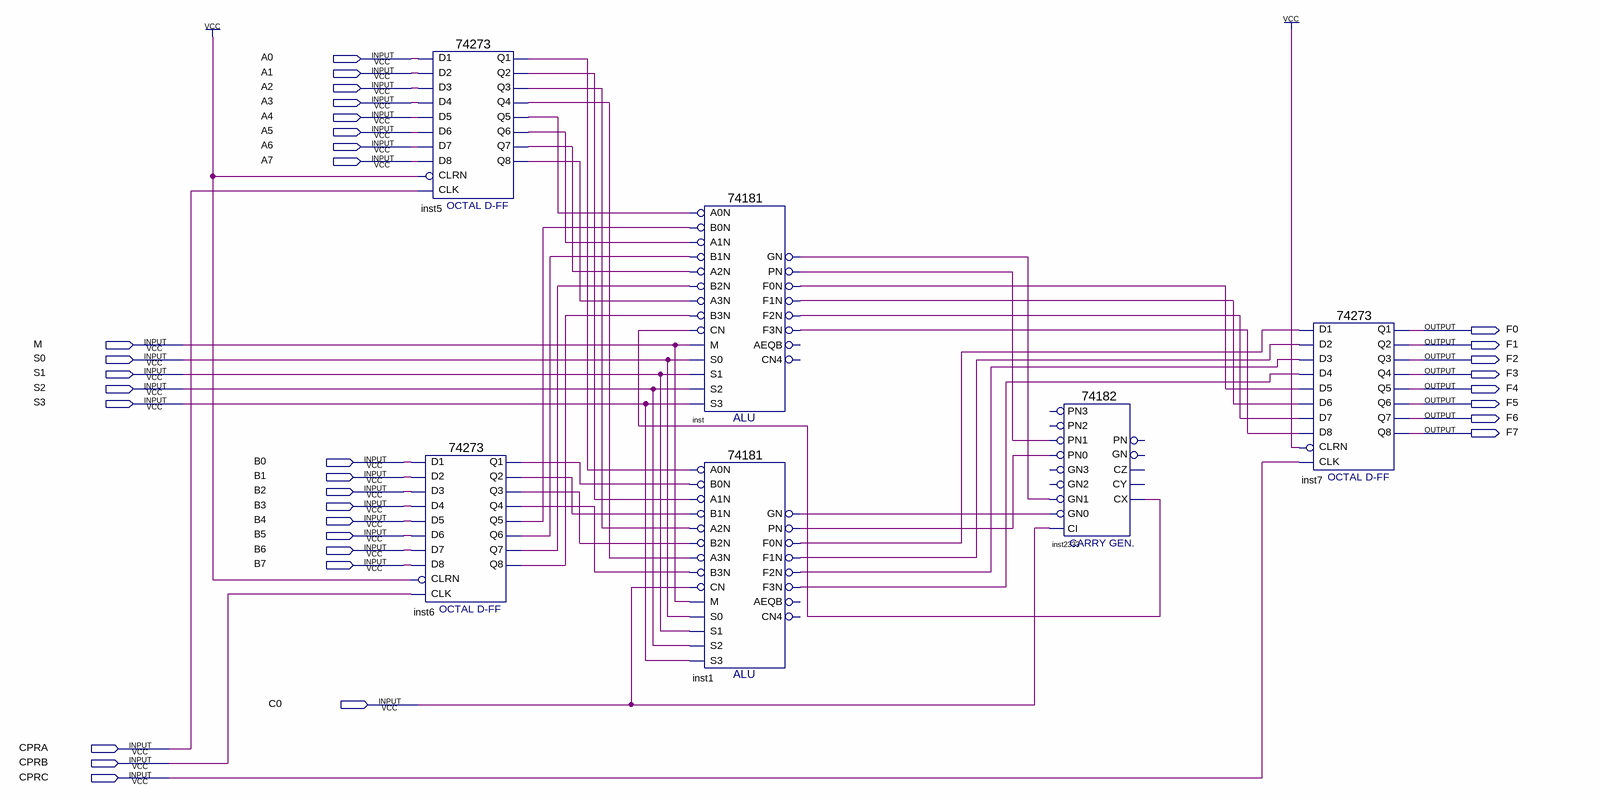
[diagram p0: schematic sheet]
// Quartus schematic ALU.bdf as structural Verilog: 6 symbols, 33 pins
module ALU (
  input  A0,
  input  A1,
  input  A2,
  input  A3,
  input  A4,
  input  A5,
  input  A6,
  input  A7,
  input  M,
  input  S0,
  input  S1,
  input  S2,
  input  S3,
  input  B0,
  input  B1,
  input  B2,
  input  B3,
  input  B4,
  input  B5,
  input  B6,
  input  B7,
  input  C0,
  input  CPRA,
  input  CPRB,
  input  CPRC,
  output F0,
  output F1,
  output F2,
  output F3,
  output F4,
  output F5,
  output F6,
  output F7
);

  wire inst1_f0n, inst1_f1n, inst1_f2n, inst1_f3n, inst1_gn, inst1_pn, inst5_q1, inst5_q2, inst5_q3,
       inst5_q4, inst5_q5, inst5_q6, inst5_q7, inst5_q8, inst6_q1, inst6_q2, inst6_q3, inst6_q4, inst6_q5,
       inst6_q6, inst6_q7, inst6_q8, inst2333_cx, inst_f0n, inst_f1n, inst_f2n, inst_f3n, inst_gn, inst_pn;

  \74273  inst5 (
    .D2(A1), .D3(A2), .D1(A0), .D4(A3), .D7(A6), .D6(A5), .D5(A4), .D8(A7), .CLK(CPRA), .CLRN(1'b1),
    .Q4(inst5_q4), .Q1(inst5_q1), .Q2(inst5_q2), .Q3(inst5_q3), .Q6(inst5_q6), .Q5(inst5_q5), .Q7(inst5_q7),
    .Q8(inst5_q8));
  \74273  inst6 (
    .D2(B1), .D3(B2), .D1(B0), .D4(B3), .D7(B6), .D6(B5), .D5(B4), .D8(B7), .CLK(CPRB), .CLRN(1'b1),
    .Q4(inst6_q4), .Q1(inst6_q1), .Q2(inst6_q2), .Q3(inst6_q3), .Q6(inst6_q6), .Q5(inst6_q5), .Q7(inst6_q7),
    .Q8(inst6_q8));
  \74181  inst (
    .B0N(inst6_q5), .A0N(inst5_q5), .A1N(inst5_q6), .B1N(inst6_q6), .A3N(inst5_q8), .B2N(inst6_q7),
    .A2N(inst5_q7), .M(M), .CN(inst2333_cx), .B3N(inst6_q8), .S2(S2), .S1(S1), .S0(S0), .S3(S3),
    .PN(inst_pn), .GN(inst_gn), .F3N(inst_f3n), .F1N(inst_f1n), .F0N(inst_f0n), .F2N(inst_f2n));  // open: AEQB, CN4
  \74181  inst1 (
    .B0N(inst6_q1), .A0N(inst5_q1), .A1N(inst5_q2), .B1N(inst6_q2), .A3N(inst5_q4), .B2N(inst6_q3),
    .A2N(inst5_q3), .M(M), .CN(C0), .B3N(inst6_q4), .S2(S2), .S1(S1), .S0(S0), .S3(S3), .PN(inst1_pn),
    .GN(inst1_gn), .F3N(inst1_f3n), .F1N(inst1_f1n), .F0N(inst1_f0n), .F2N(inst1_f2n));  // open: AEQB, CN4
  \74182  inst2333 (
    .CI(C0), .PN1(inst_pn), .PN0(inst1_pn), .GN1(inst_gn), .GN0(inst1_gn), .CX(inst2333_cx));  // open: PN2, GN2, GN3, PN3, CY, PN, CZ, GN
  \74273  inst7 (
    .D2(inst1_f1n), .D3(inst1_f2n), .D1(inst1_f0n), .D4(inst1_f3n), .D7(inst_f2n), .D6(inst_f1n),
    .D5(inst_f0n), .D8(inst_f3n), .CLK(CPRC), .CLRN(1'b1), .Q4(F3), .Q1(F0), .Q2(F1), .Q3(F2), .Q6(F5),
    .Q5(F4), .Q7(F6), .Q8(F7));
endmodule
